# EAGLE schematic RGBledMiniStick (EAGLE 6.5.0)
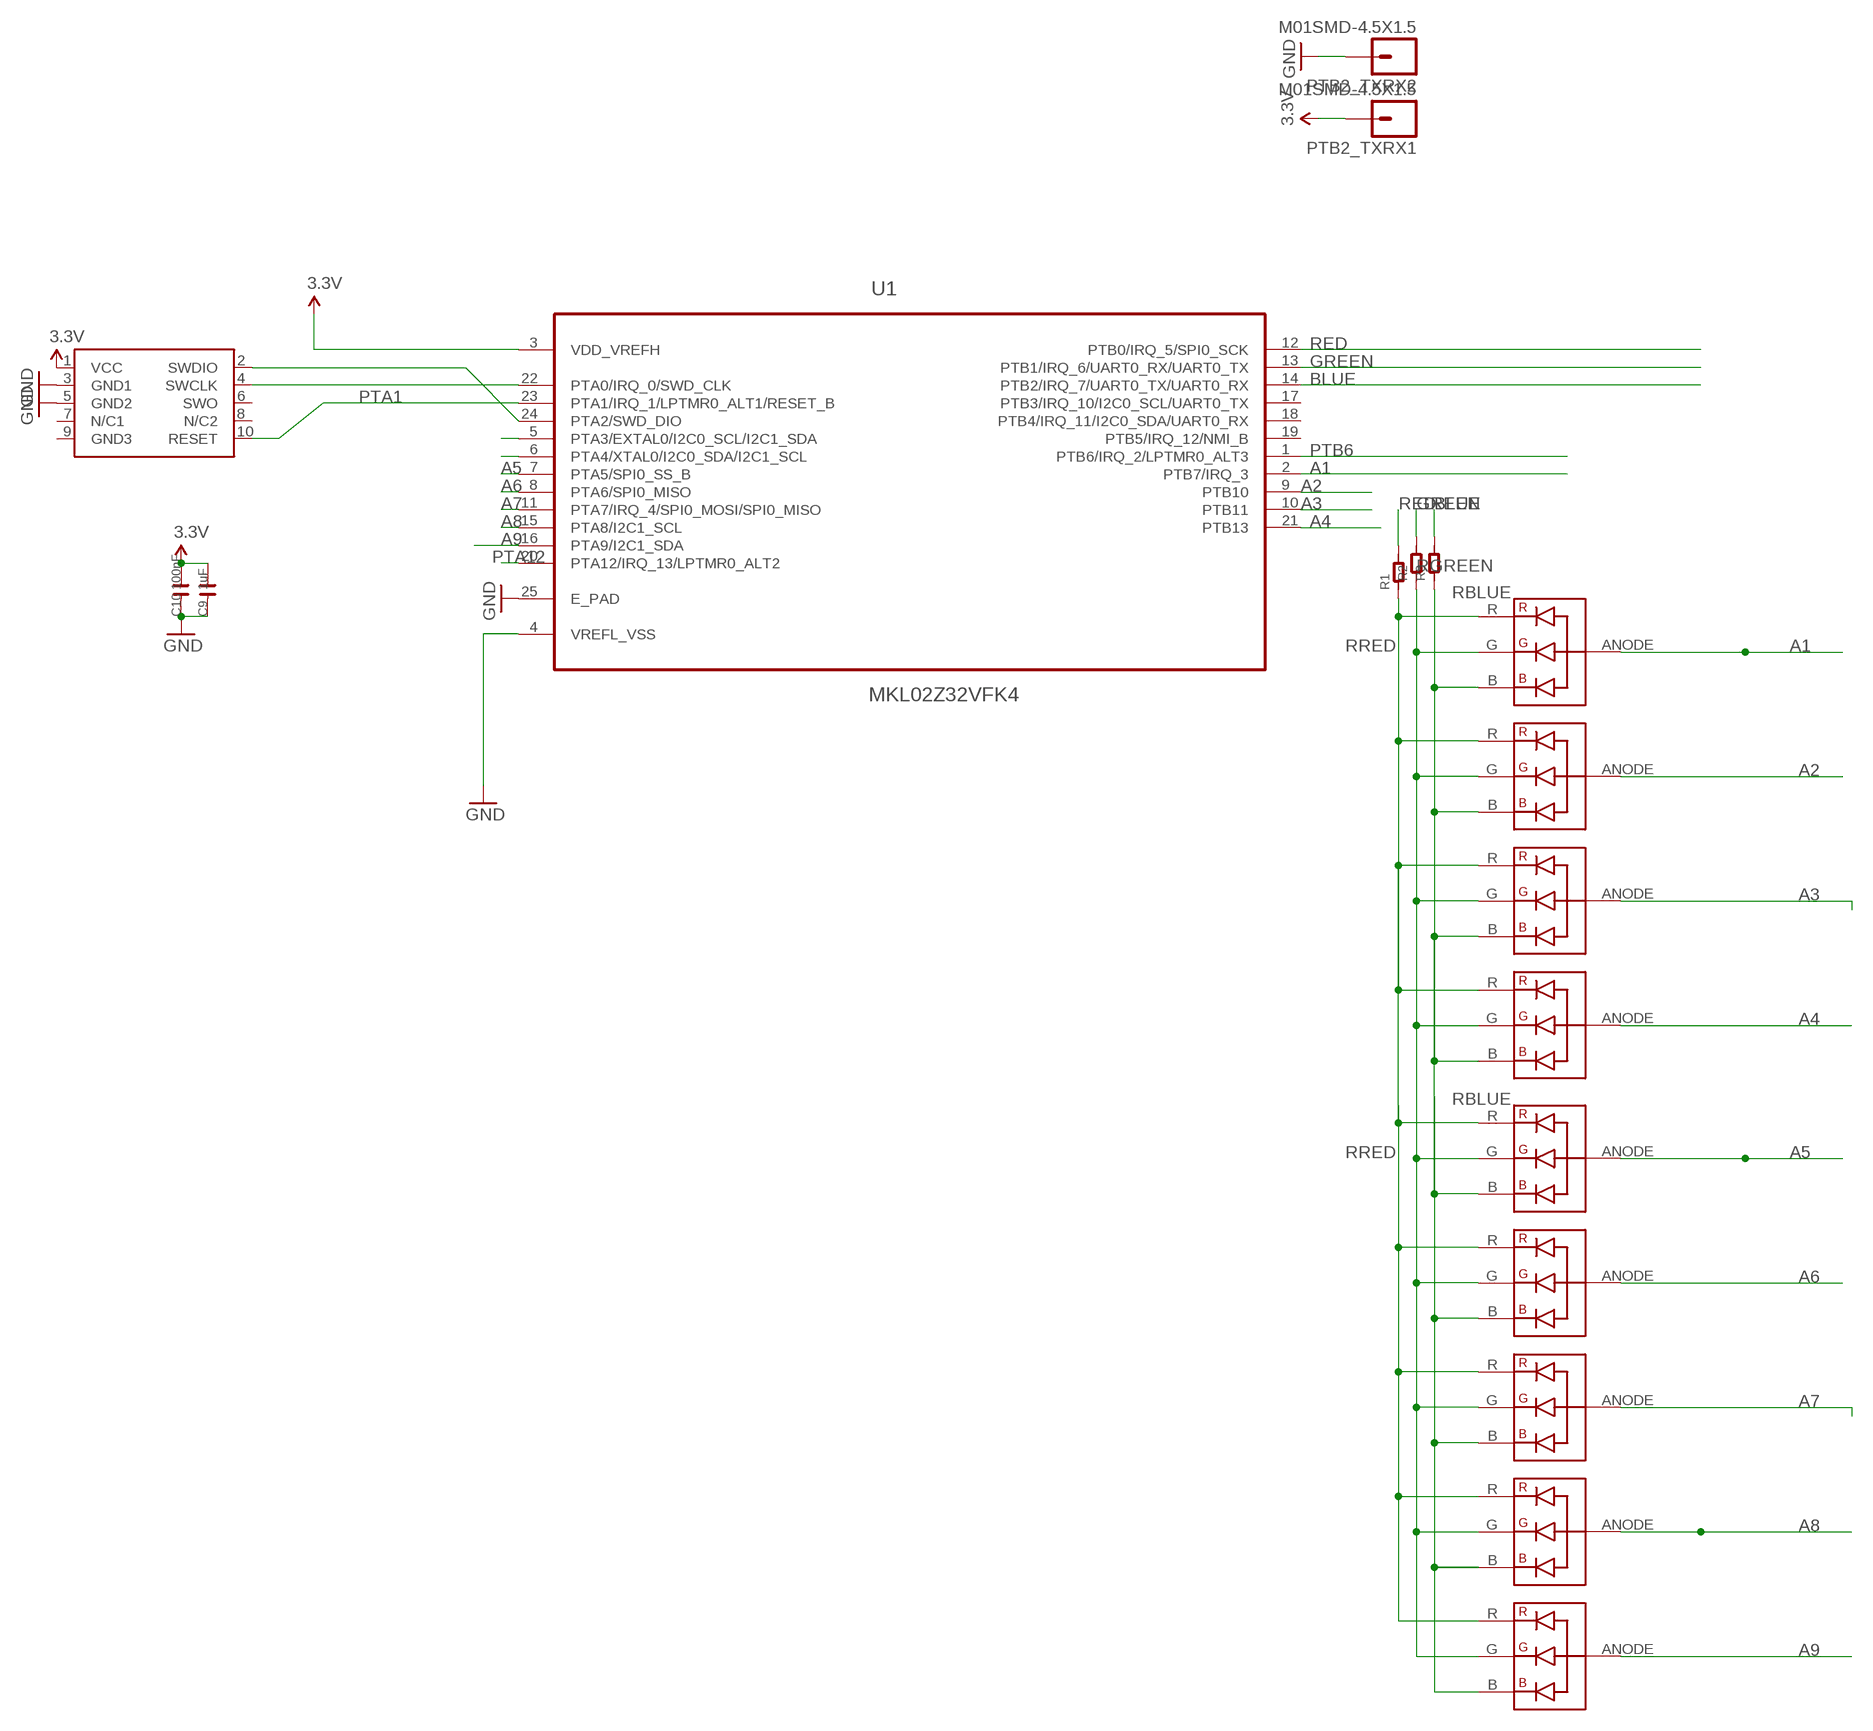
[diagram p0: schematic, sheet 1]

## Parts
C9  1uF  C-0603  [C0603]
C10  100nF  C-0603  [C0603]
PTB2_TXRX1  M01SMD-4.5X1.5  [PAD-1.5X4.5]
PTB2_TXRX2  M01SMD-4.5X1.5  [PAD-1.5X4.5]
R1  R-0603  [R0603]
R2  R-0603  [R0603]
R3  R-0603  [R0603]
SWD1  CORTEX_SWD  [M50-3600542]
U1  MKL02Z32VFK4  [QFN50P400X400X100-25N]
U$1  RGBLED_COMMONANODE  [3.5X2.8_RGB_LED]
U$2  RGBLED_COMMONANODE  [3.5X2.8_RGB_LED]
U$3  RGBLED_COMMONANODE  [3.5X2.8_RGB_LED]
U$4  RGBLED_COMMONANODE  [3.5X2.8_RGB_LED]
U$5  RGBLED_COMMONANODE  [3.5X2.8_RGB_LED]
U$6  RGBLED_COMMONANODE  [3.5X2.8_RGB_LED]
U$7  RGBLED_COMMONANODE  [3.5X2.8_RGB_LED]
U$8  RGBLED_COMMONANODE  [3.5X2.8_RGB_LED]
U$9  RGBLED_COMMONANODE  [3.5X2.8_RGB_LED]

## Nets
3.3V: C9.2 C10.2 PTB2_TXRX1.P$1 SWD1.1(VCC) U1.3(VDD_VREFH)
A1: U1.2(PTB7/IRQ_3) U$1.ANODE
A2: U1.9(PTB10) U$2.ANODE
A3: U1.10(PTB11) U$3.ANODE
A4: U1.21(PTB13) U$4.ANODE
A5: U1.7(PTA5/SPI0_SS_B) U$5.ANODE
A6: U1.8(PTA6/SPI0_MISO) U$6.ANODE
A7: U1.11(PTA7/IRQ_4/SPI0_MOSI/SPI0_MISO) U$7.ANODE
A8: U1.15(PTA8/I2C1_SCL) U$8.ANODE
A9: U1.16(PTA9/I2C1_SDA) U$9.ANODE
BLUE: R3.2 U1.14(PTB2/IRQ_7/UART0_TX/UART0_RX)
GND: C9.1 C10.1 PTB2_TXRX2.P$1 SWD1.3(GND1) SWD1.5(GND2) U1.4(VREFL_VSS) U1.25(E_PAD)
GREEN: R2.2 U1.13(PTB1/IRQ_6/UART0_RX/UART0_TX)
N$1: U1.5(PTA3/EXTAL0/I2C0_SCL/I2C1_SDA)
N$2: U1.6(PTA4/XTAL0/I2C0_SDA/I2C1_SCL)
N$5: SWD1.4(SWCLK) U1.22(PTA0/IRQ_0/SWD_CLK)
N$7: SWD1.2(SWDIO) U1.24(PTA2/SWD_DIO)
PTA1: SWD1.10(RESET) U1.23(PTA1/IRQ_1/LPTMR0_ALT1/RESET_B)
PTA12: U1.20(PTA12/IRQ_13/LPTMR0_ALT2)
PTB6: U1.1(PTB6/IRQ_2/LPTMR0_ALT3)
RBLUE: R3.1 U$1.B U$2.B U$3.B U$4.B U$5.B U$6.B U$7.B U$8.B U$9.B
RED: R1.2 U1.12(PTB0/IRQ_5/SPI0_SCK)
RGREEN: R2.1 U$1.G U$2.G U$3.G U$4.G U$5.G U$6.G U$7.G U$8.G U$9.G
RRED: R1.1 U$1.R U$2.R U$3.R U$4.R U$5.R U$6.R U$7.R U$8.R U$9.R
Unconnected: SWD1.6(SWO) SWD1.7(N/C1) SWD1.8(N/C2) SWD1.9(GND3) U1.17(PTB3/IRQ_10/I2C0_SCL/UART0_TX) U1.18(PTB4/IRQ_11/I2C0_SDA/UART0_RX) U1.19(PTB5/IRQ_12/NMI_B)

## Library data of the parts
C9 C10 = OPL:C*
PTB2_TXRX1 PTB2_TXRX2 = SparkFun-Connectors:M01: Header 1 Standard 1-pin 0.1" header. Use with straight break away headers (SKU : PRT-00116), right angle break away headers (PRT-00553), swiss pins (PRT-00743), machine pins (PRT-00117), and female headers (PRT-00115).
R1-R3 = OPL:R*
SWD1 = carrilib with jtags:CORTEX_SWD: .05" Cortex M Connector in SWD mode Manufacturer: Generic Part Number: Cortex M SWD Notes: I use Harwin M50-3600542 connectors
U1 = FarnellThings:MKL02Z32VFK4: IC, MCU, 32BIT, CORTEX M0+, 48MHZ, QFN-24; MPN: MKL02Z32VFK4; OC_FARNELL: 2321481; OC_NEWARK: 61W9887; PACKAGE: QFN-24; SUPPLIER: FREESCALE SEMICONDUCTOR
U$1-U$9 = zephod-components:RGBLED_COMMONANODE